# EAGLE design Adapter_1.1 (EAGLE 7.6.0)
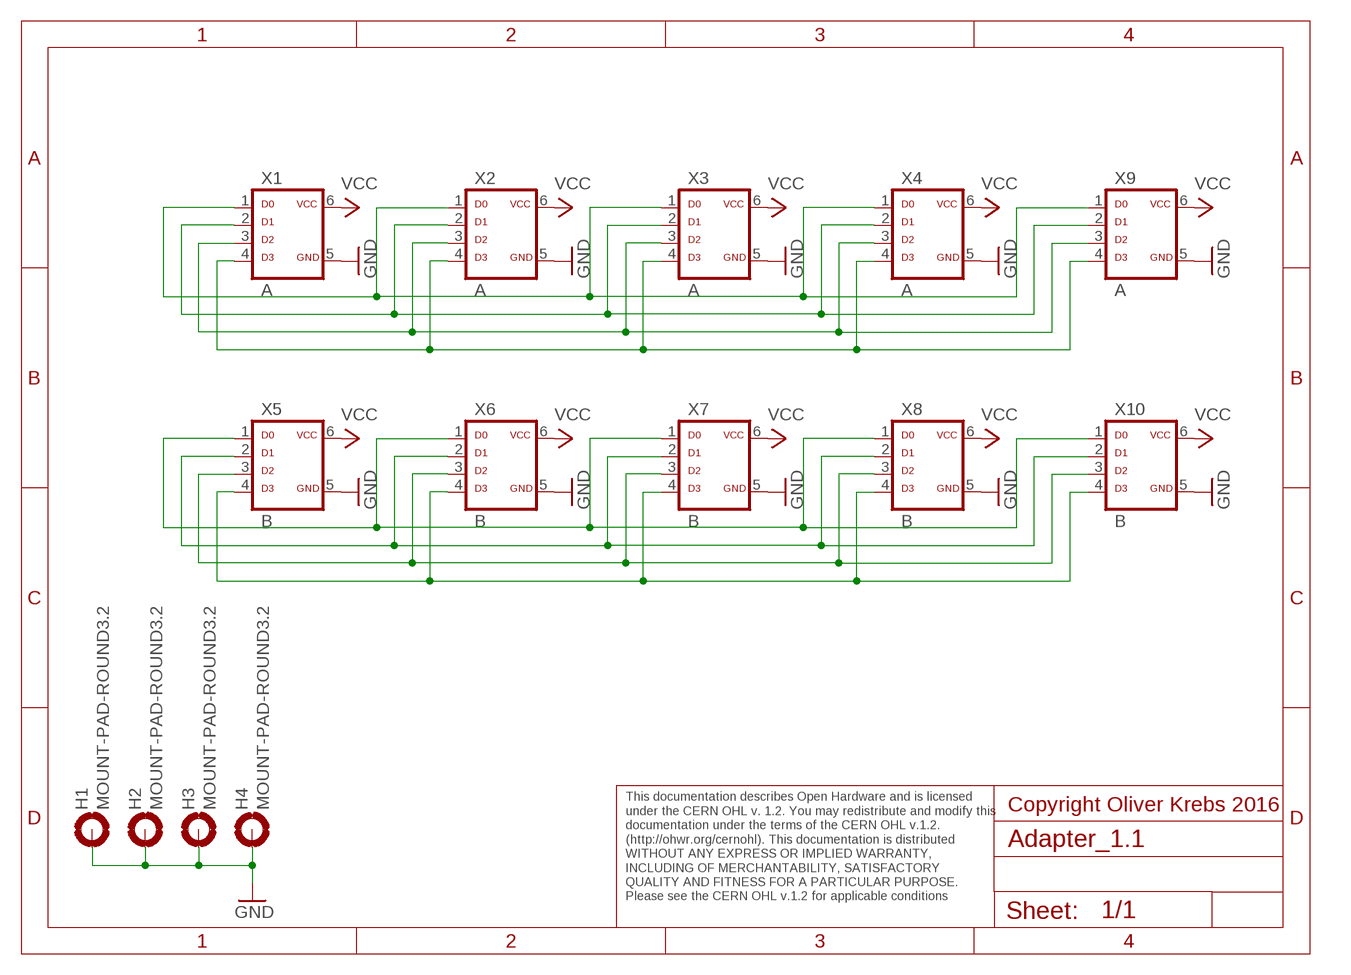
[diagram p0: schematic, sheet 1]

## Parts
H1  MOUNT-PAD-ROUND3.2  [3,2-PAD]
H2  MOUNT-PAD-ROUND3.2  [3,2-PAD]
H3  MOUNT-PAD-ROUND3.2  [3,2-PAD]
H4  MOUNT-PAD-ROUND3.2  [3,2-PAD]
X1  A  ML6D  [ML-6]
X2  A  ML6D  [ML-6]
X3  A  ML6D  [ML-6]
X4  A  ML6D  [ML-6]
X5  B  ML6D  [ML-6]
X6  B  ML6D  [ML-6]
X7  B  ML6D  [ML-6]
X8  B  ML6D  [ML-6]
X9  A  ML6D  [ML-6]
X10  B  ML6D  [ML-6]

## Nets
GND: H1.B3,2(MOUNT) H2.B3,2(MOUNT) H3.B3,2(MOUNT) H4.B3,2(MOUNT) X1.5 X2.5 X3.5 X4.5 X5.5 X6.5 X7.5 X8.5 X9.5 X10.5
N$1: X1.1 X2.1 X3.1 X4.1 X9.1
N$4: X1.2 X2.2 X3.2 X4.2 X9.2
N$7: X1.3 X2.3 X3.3 X4.3 X9.3
N$8: X1.4 X2.4 X3.4 X4.4 X9.4
N$11: X5.1 X6.1 X7.1 X8.1 X10.1
N$12: X5.2 X6.2 X7.2 X8.2 X10.2
N$13: X5.3 X6.3 X7.3 X8.3 X10.3
N$14: X5.4 X6.4 X7.4 X8.4 X10.4
VCC: X1.6 X2.6 X3.6 X4.6 X5.6 X6.6 X7.6 X8.6 X9.6 X10.6

## Notes on the sheet
- Copyright Oliver Krebs 2016
- This documentation describes Open Hardware and is licensed 
  under the CERN OHL v. 1.2. You may redistribute and modify this 
  documentation under the terms of the CERN OHL v.1.2. 
  (http://ohwr.org/cernohl). This documentation is distributed
  WITHOUT ANY EXPRESS OR IMPLIED WARRANTY, 
  INCLUDING OF MERCHANTABILITY, SATISFACTORY 
  QUALITY AND FITNESS FOR A PARTICULAR PURPOSE. 
  Please see the CERN OHL v.1.2 for applicable conditions

## Library data of the parts
H1-H4 = holes:MOUNT-PAD-ROUND: MOUNTING PAD, round
X1-X10 = 01-my-con:ML6D

## Board
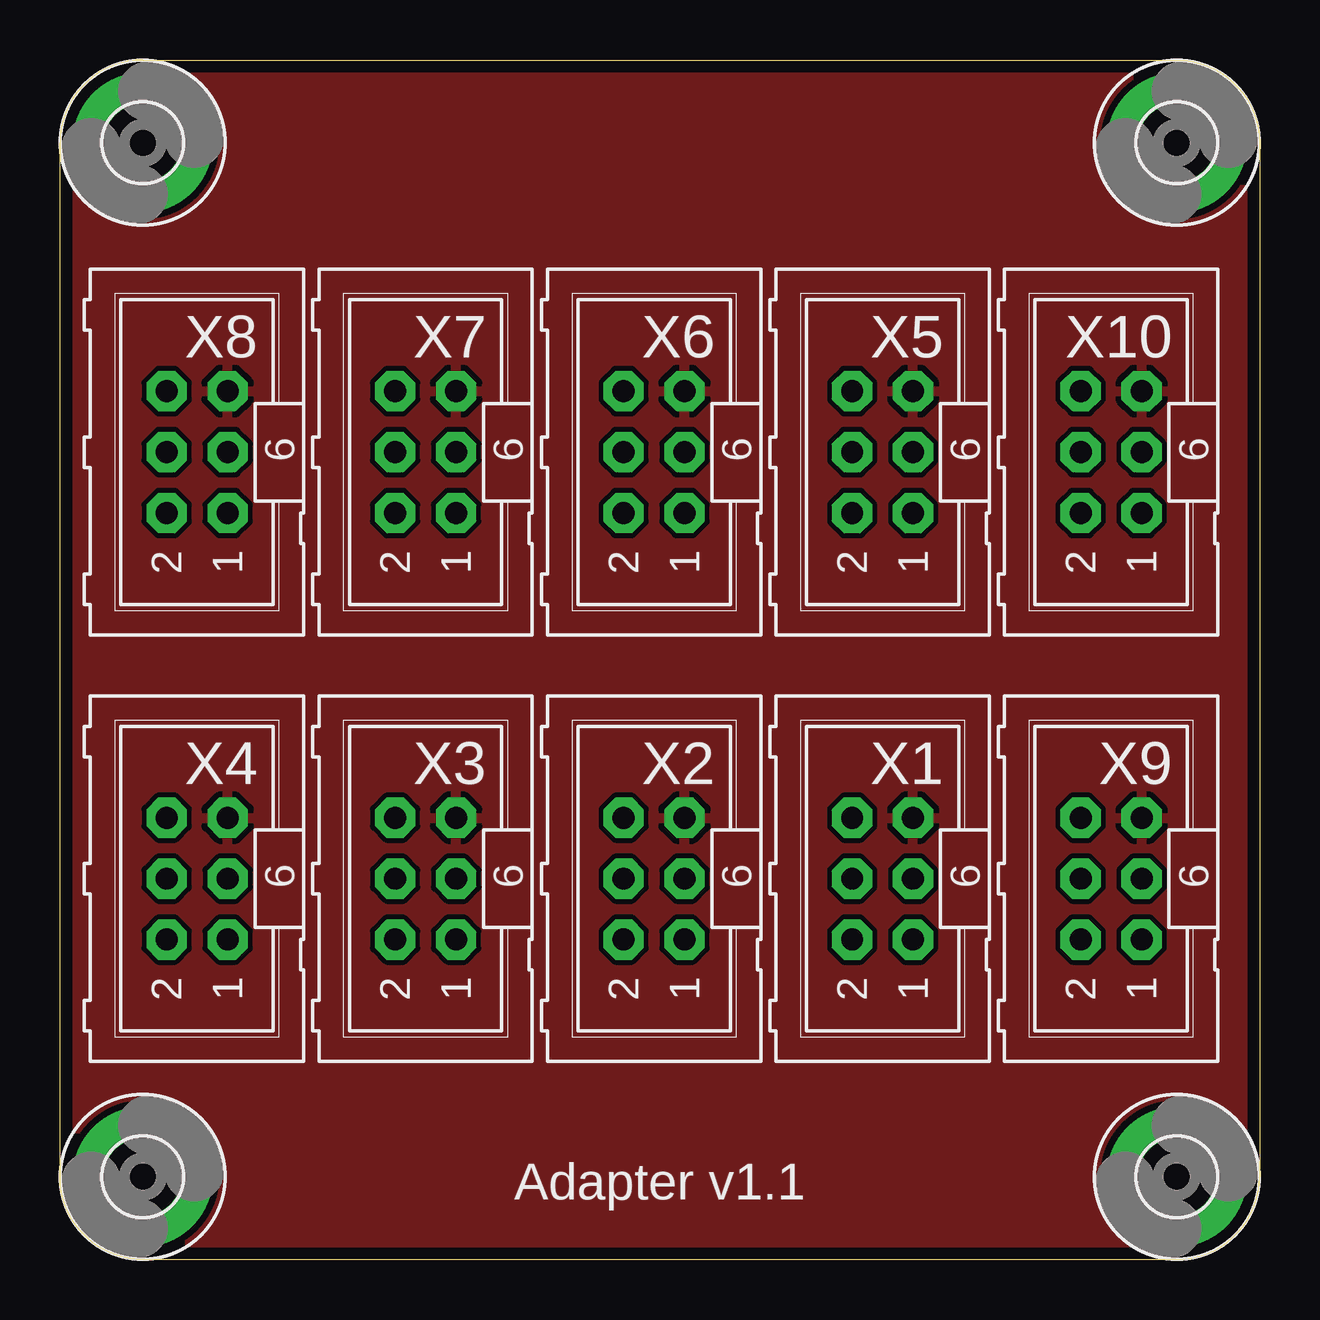
[diagram p1: board, top side]
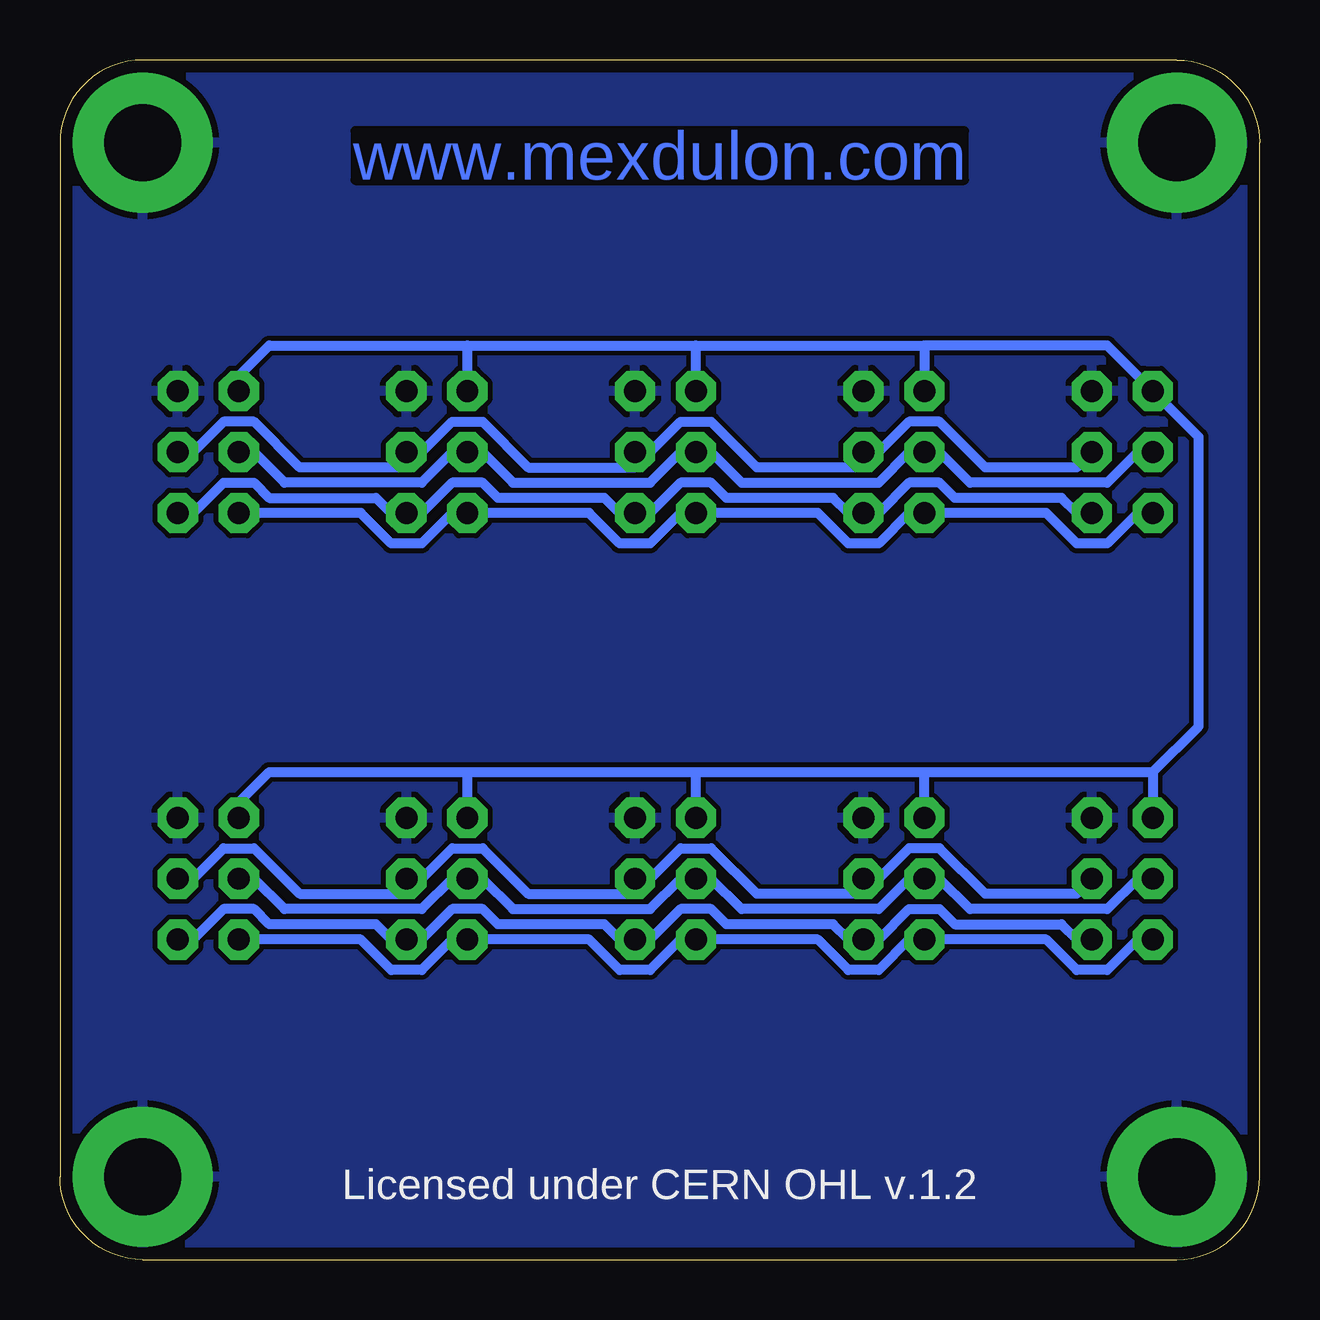
[diagram p2: board, bottom side, seen from below]

Size 50 x 50 mm. Coordinates in mm from the lower left corner, seen from the top.
Outline: 0,3.45 0,46.55 arc-90 3.45,50 46.55,50 arc-90 50,46.55 50,3.45 arc-90 46.55,0 3.45,0 arc-90 0,3.45
Copper layers (1*16): Top 0.035mm / dielectric 1.6mm / Bottom 0.035mm
Design rules "Elecrow_2-layer_PCB_eagle_rule": minimum track width 6mil, minimum drill 12mil, track to track 6mil, track to pad 6mil, pad to pad 6mil, via to via 8mil, smd to smd 0mil, copper to edge 20mil, drill to drill 10mil, minimum pad ring 6mil, minimum via ring 6mil, stop-mask expansion 0mil, vias tented up to drill 100mil, thermal gap 10mil

### Footprints (pad centres in the part's own frame; a part is rotated, then mirrored left to right if it is on the bottom)
3,2-PAD = drill 3.2 pad 5.842: B3,2 0,0
ML-6 = drill 0.914 pad 1.676 octagon: 1 -2.54,-1.27; 2 -2.54,1.27; 3 0,-1.27; 4 0,1.27; 5 2.54,-1.27; 6 2.54,1.27

### Placement (x,y rotation side)
H1  3.45,3.45 0 top
H2  3.45,46.55 0 top
H3  46.55,46.55 0 top
H4  46.55,3.45 0 top
X1  34.29,15.88 90 top
X2  24.77,15.88 90 top
X3  15.24,15.88 90 top
X4  5.71,15.88 90 top
X5  34.29,33.66 90 top
X6  24.77,33.66 90 top
X7  15.24,33.66 90 top
X8  5.71,33.66 90 top
X9  43.81,15.88 90 top
X10  43.81,33.66 90 top

### Tracks (layer width: path | path; a pad name or v marks a point on that pad's centre or on a via)
GND
  pour Top (isolate 0.203): 0,50.16 50.16,50.16 50.16,0 0,0
  pour Bottom (isolate 0.203): 0,50.16 50.16,50.16 50.16,0 0,0
N$1
  Bottom 0.406: X4.1 7.62,13.34 8.26,13.97 12.7,13.97 13.34,14.61 14.61,14.61 15.88,13.34 X3.1 17.14,13.34 17.78,13.97 22.23,13.97 22.86,14.61 24.13,14.61 25.4,13.34 X2.1 26.67,13.34 27.3,13.97 31.75,13.97 32.38,14.61 33.66,14.61 34.92,13.34 X1.1 36.2,13.34 36.83,13.97 41.27,13.97 41.91,14.61 43.18,14.61 44.45,13.34 X9.1
N$4
  Bottom 0.406: X4.2 5.08,13.34 6.35,12.06 7.62,12.06 8.89,13.34 X3.2 14.61,13.34 15.88,12.06 17.14,12.06 18.41,13.34 X2.2 24.13,13.34 25.4,12.06 26.67,12.06 27.94,13.34 X1.2 33.66,13.34 34.92,12.06 36.2,12.06 37.47,13.34 X9.2
N$7
  Bottom 0.406: 16.19,15.56 14.61,17.14 13.34,17.14 11.43,15.24 7.62,15.24 X4.3 | 16.19,15.56 16.51,15.24 20.95,15.24 22.86,17.14 24.13,17.14 25.72,15.56 | 25.72,15.56 26.04,15.24 30.48,15.24 32.38,17.14 33.66,17.14 35.24,15.56 | 35.24,15.56 35.56,15.24 40.01,15.24 41.91,17.14 43.18,17.14 44.45,15.88 X9.3 | X2.3 25.72,15.56 | X3.3 16.19,15.56 | X1.3 35.24,15.56
N$8
  Bottom 0.406: X4.4 5.08,15.88 6.35,14.61 12.06,14.61 13.34,15.88 X3.4 14.61,15.88 15.88,14.61 21.59,14.61 22.86,15.88 X2.4 24.13,15.88 25.4,14.61 31.11,14.61 32.38,15.88 X1.4 33.66,15.88 34.92,14.61 40.64,14.61 41.91,15.88 X9.4
N$11
  Bottom 0.406: X8.1 7.62,31.11 8.26,31.75 12.7,31.75 13.34,32.38 14.61,32.38 15.88,31.11 X7.1 17.14,31.11 17.78,31.75 22.23,31.75 22.86,32.38 24.13,32.38 25.4,31.11 X6.1 26.67,31.11 27.3,31.75 31.75,31.75 32.38,32.38 33.66,32.38 34.92,31.11 X5.1 36.2,31.11 36.83,31.75 41.27,31.75 41.91,32.38 43.18,32.38 44.45,31.11 X10.1
N$12
  Bottom 0.406: X8.2 5.08,31.11 6.35,29.84 7.62,29.84 8.89,31.11 X7.2 14.61,31.11 15.88,29.84 17.14,29.84 18.41,31.11 X6.2 24.13,31.11 25.4,29.84 26.67,29.84 27.94,31.11 X5.2 33.66,31.11 34.92,29.84 36.2,29.84 37.47,31.11 X10.2
N$13
  Bottom 0.406: 35.24,33.34 35.56,33.02 40.01,33.02 41.91,34.92 43.18,34.92 44.45,33.66 X10.3 | 35.24,33.34 33.66,34.92 32.38,34.92 30.48,33.02 26.04,33.02 25.72,33.34 | 25.72,33.34 24.13,34.92 22.86,34.92 20.95,33.02 16.51,33.02 16.19,33.34 | 16.19,33.34 14.61,34.92 13.34,34.92 11.43,33.02 7.62,33.02 X8.3 | X7.3 16.19,33.34 | X6.3 25.72,33.34 | X5.3 35.24,33.34
N$14
  Bottom 0.406: X8.4 5.08,33.66 6.35,32.38 12.06,32.38 13.34,33.66 X7.4 14.61,33.66 15.88,32.38 21.59,32.38 22.86,33.66 X6.4 24.13,33.66 25.4,32.38 31.11,32.38 32.38,33.66 X5.4 33.66,33.66 34.92,32.38 40.64,32.38 41.91,33.66 X10.4
VCC
  Bottom 0.406: X3.6 13.97,20.32 | 13.97,20.32 4.45,20.32 | 4.45,20.32 X4.6 | X2.6 23.5,20.32 | 23.5,20.32 13.97,20.32 | X6.6 23.5,38.1 | 23.5,38.1 13.97,38.1 | 13.97,38.1 X7.6 | 13.97,38.1 6.35,38.1 X8.6 2.54,34.29 2.54,22.23 4.45,20.32 | X1.6 33.02,20.32 | 33.02,20.32 23.5,20.32 | X5.6 33.02,38.1 | 33.02,38.1 23.5,38.1 | X10.6 42.55,36.83 41.27,38.1 33.02,38.1 | X9.6 42.55,19.05 41.27,20.32 33.02,20.32

### Text on the board
Bottom: www.mexdulon.com
tNames: Adapter v1.1
bNames: Licensed under CERN OHL v.1.2